# EAGLE design base-3u-psu (EAGLE 4.16)
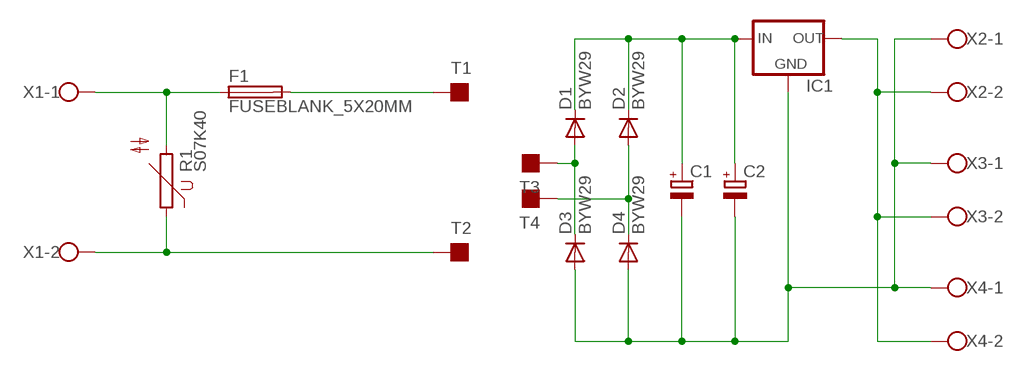
[diagram p0: schematic, sheet 1]

## Parts
C1  CPOL-EUE5-10.5  [E5-10,5]
C2  CPOL-EUE5-10.5  [E5-10,5]
D1  BYW29  [DO220S]
D2  BYW29  [DO220S]
D3  BYW29  [DO220S]
D4  BYW29  [DO220S]
F1  FUSEBLANK_5X20MM  [FUSE_HOLDER_5X20MM]
IC1  78XXS  [78XXS]
R1  S07K40  [S07K40]
T1  TESTPOINTAWG24  [HOLEAWG24]
T2  TESTPOINTAWG24  [HOLEAWG24]
T3  TESTPOINTAWG24  [HOLEAWG24]
T4  TESTPOINTAWG24  [HOLEAWG24]
X1  W237-102  [W237-102]
X2  W237-102  [W237-102]
X3  W237-102  [W237-102]
X4  W237-102  [W237-102]

## Nets
GND: C1.- C2.- D3.A D4.A IC1.GND X2.1 X3.1 X4.1
N$1: C1.+ C2.+ D1.C D2.C IC1.IN
N$2: D1.A D3.C T3.P$1
N$3: D2.A D4.C T4.P$1
N$8: F1.1 R1.2 X1.1
N$9: R1.1 T2.P$1 X1.2
N$10: F1.2 T1.P$1
N$11: IC1.OUT X2.2 X3.2 X4.2

## Library data of the parts
C1 C2 = rcl:CPOL-EU: POLARIZED CAPACITOR, European symbol
D1-D4 = diode:BYW29: DIODE ultra fast rectifier, 200 V, 8 A
F1 = fuse:FUSE: Fuse
IC1 = v-reg:78XXS: VOLTAGE REGULATOR
R1 = varistor:S07K40: VARISTOR
T1-T4 = ads4:TESTPOINT: Test point
X1-X4 = con-wago-500:W237-102: WAGO SCREW CLAMP

## Board
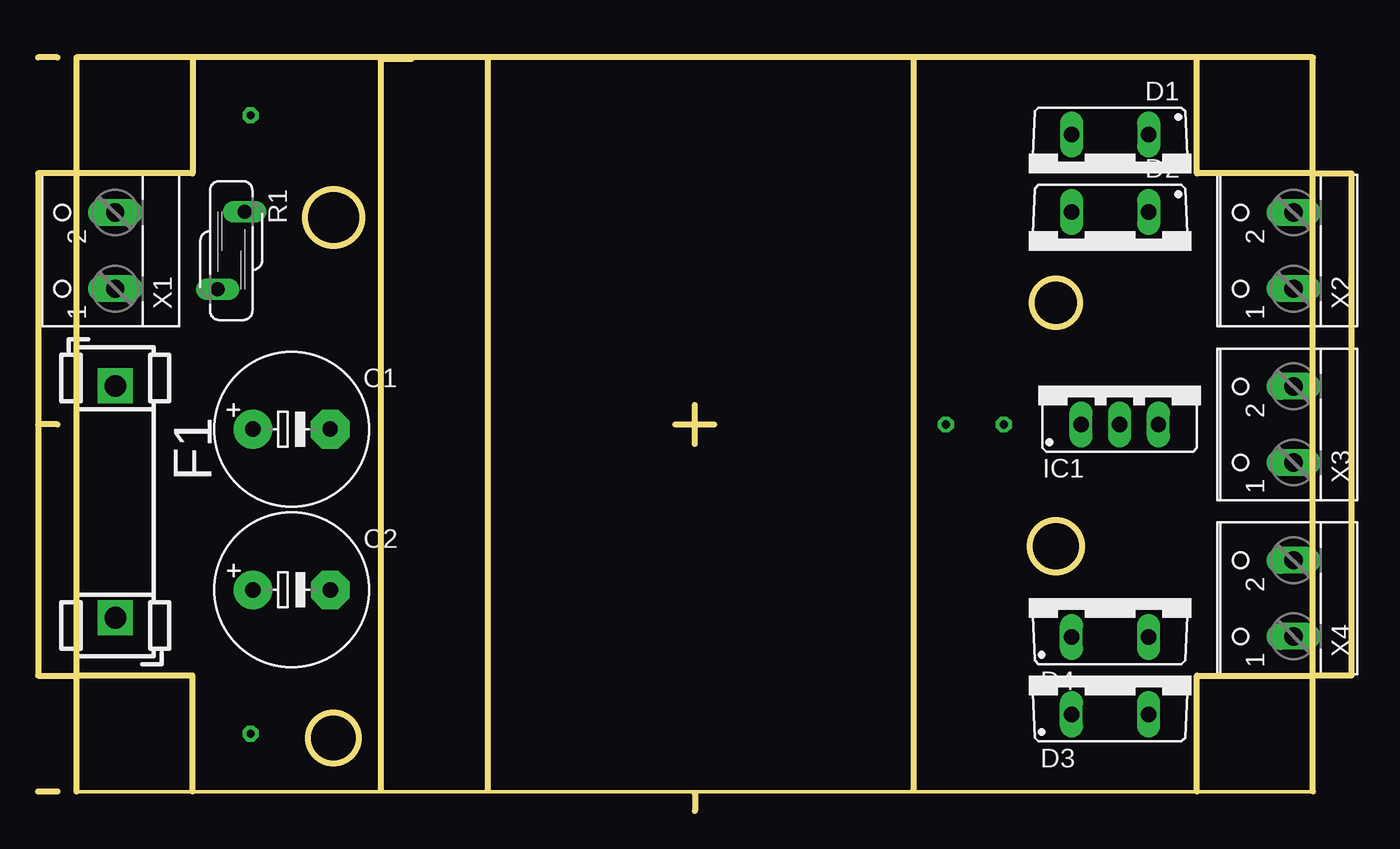
[diagram p1: board, top side]
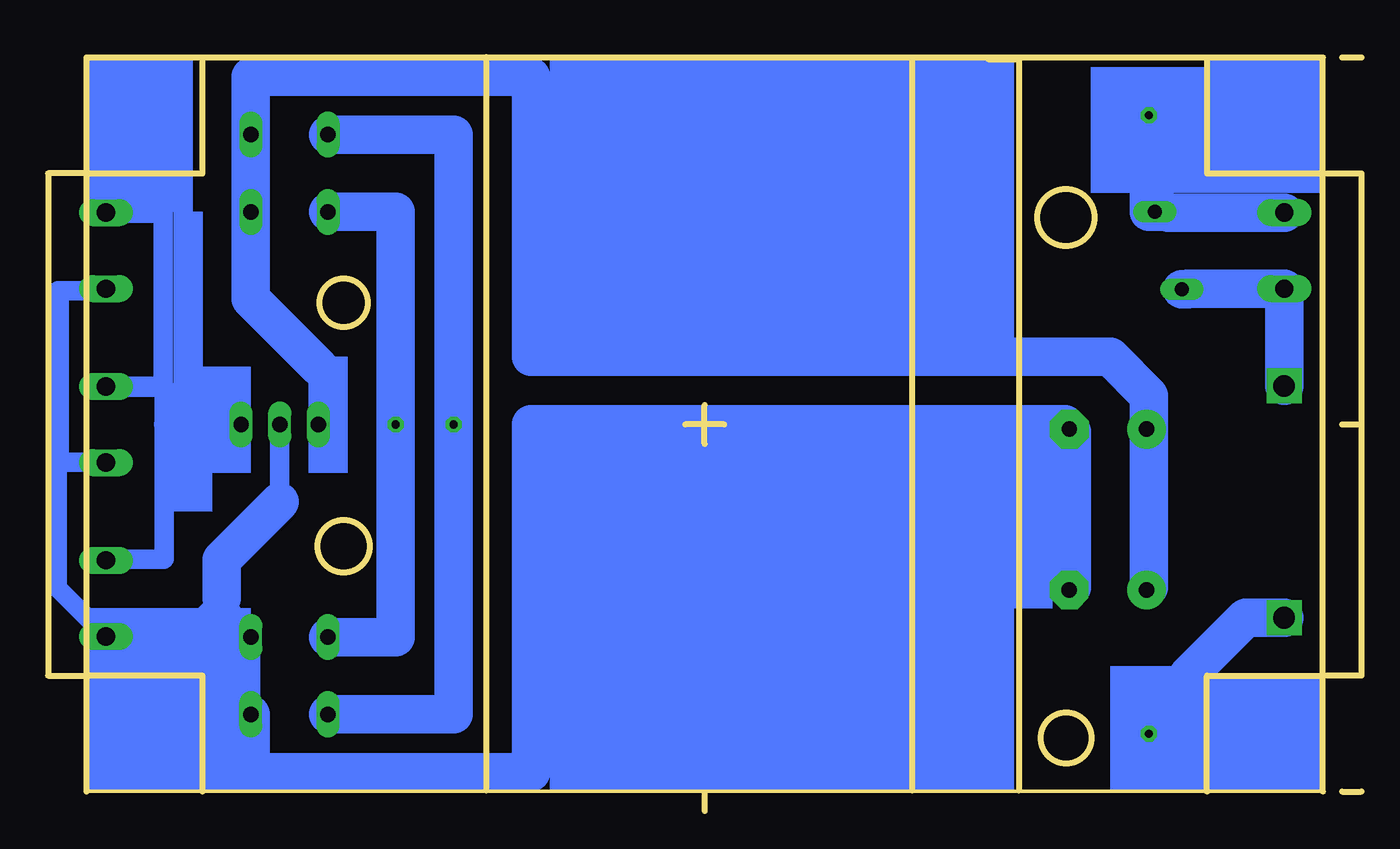
[diagram p2: board, bottom side, seen from below]

Size 86.36 x 49.56 mm. Coordinates in mm from the lower left corner, seen from the top.
Outline: 2.54,1.29 83.82,1.25
Outline: 43.18,1.13 43.18,0
Outline: 1.27,49.53 0,49.53
Outline: 1.27,1.27 0,1.27
Outline: 1.27,25.4 0,25.4
Outline: 41.91,25.4 44.45,25.4
Outline: 43.18,24.13 43.18,26.67
Outline: 2.54,1.27 2.54,8.89
Outline: 2.54,8.89 2.54,41.91
Outline: 2.54,41.91 2.54,49.53 10.16,49.53
Outline: 83.82,1.27 83.82,8.89
Outline: 83.82,8.89 83.82,41.91
Outline: 83.82,41.91 83.82,49.53 76.2,49.53
Outline: 76.2,49.53 10.16,49.53
Outline: 10.16,1.27 10.16,8.89 2.54,8.89
Outline: 76.2,1.27 76.2,8.89 83.82,8.89
Outline: 83.82,41.91 76.2,41.91 76.2,49.53
Outline: 10.16,49.53 10.16,41.91 2.54,41.91
Outline: 2.54,41.91 0,41.91 0,8.89 2.54,8.89
Outline: 83.82,41.91 86.36,41.91 86.36,8.89 83.82,8.89
Outline: 29.58,49.52 29.54,49.52 29.54,1.36
Outline: 57.54,49.56 57.54,1.35
Outline: 24.54,49.41 22.54,49.41 22.54,1.36
Outline: circle at 19.43,39 radius 1.86
Outline: circle at 19.43,4.8 radius 1.66
Outline: circle at 66.93,17.4 radius 1.71
Outline: circle at 66.93,33.4 radius 1.57
Copper layers (1*16): Top 0.035mm / dielectric 1.5mm / Bottom 0.035mm
Design rules "default": minimum track width 10mil, minimum drill 24mil, track to track 8mil, track to pad 8mil, pad to pad 8mil, via to via 8mil, smd to smd 8mil, copper to edge 40mil, drill to drill 8mil, minimum pad ring 10mil, minimum via ring 8mil, stop-mask expansion 4mil, vias tented up to drill 0mil, thermal gap 10mil

### Footprints (pad centres in the part's own frame; a part is rotated, then mirrored left to right if it is on the bottom)
E5-10,5 = drill 1.016 pad 2.54 round: + -2.54,0 | drill 1.016 pad 2.54 octagon: - 2.54,0
DO220S = drill 1.016 long: A 2.54,-2.54; C -2.54,-2.54
FUSE_HOLDER_5X20MM = drill 1.422 pad 2.286 square: 1 0,0; 2 15.24,0
78XXS = drill 1.016 long: GND 0,-2.54; IN -2.54,-2.54; OUT 2.54,-2.54
S07K40 = drill 0.914 long: 1 -0.889,-2.54; 2 0.889,2.54
HOLEAWG24 = drill 0.533 pad 0.787 octagon: P$1 0,0
W237-102 = drill 1.194 long: 1 -2.5,-1.27; 2 2.5,-1.27

### Placement (x,y rotation side)
C1  16.66,25.09 0 top
C2  16.68,14.53 0 top
D1  70.48,41.91 180 top
D2  70.48,36.83 180 top
D3  70.48,8.89 0 top
D4  70.48,13.97 0 top
F1  5.08,27.94 270 top
IC1  71.12,27.94 0 top
R1  12.7,36.83 180 top
T1  13.97,5.08 0 top
T2  13.97,45.72 0 top
T3  59.69,25.4 0 top
T4  63.5,25.4 0 top
X1  3.81,36.83 90 top
X2  81.28,36.83 90 top
X3  81.28,25.4 90 top
X4  81.28,13.97 90 top

### Tracks (layer width: path | path; a pad name or v marks a point on that pad's centre or on a via)
GND
  Bottom 1.27: 82.53,22.93 82.38,22.93 | 82.53,22.93 X3.1 | 85.62,22.93 85.75,22.8 85.75,14.66 X4.1 82.55,11.43 77.47,11.43 74.93,13.97 D4.A D3.A | 85.62,22.93 82.53,22.93 | X2.1 82.69,34.2 85.7,34.2 85.64,34.13 85.64,22.93 85.62,22.93 | 71.12,20.32 IC1.GND
  Bottom 2.54: 71.12,20.32 74.93,16.51 74.93,13.97 | C2.- 19.05,14.7 19.05,24.93 C1.- 19.52,25.4 54.61,25.4 54.61,2.54 73.03,2.54 D3.A
N$1
  Bottom 1.27: 68.58,29.21 IC1.IN
  Bottom 2.54: 68.58,29.21 73.03,33.66 D2.C D1.C 73.03,48.26 54.61,48.26 54.61,29.84 16.51,29.84 13.97,27.3 13.97,25.25 C1.+ 13.97,24.93 13.97,14.7 C2.+
N$2
  Bottom 2.54: D3.C 59.69,6.35 T3.P$1 59.69,44.45 D1.A
N$3
  Bottom 2.54: D2.A 63.5,39.37 T4.P$1 63.5,11.43 D4.C
N$8
  Bottom 2.54: F1.1 X1.1 11.43,34.33 11.43,34.29 R1.2
N$9
  Bottom 2.54: X1.2 12.7,39.33 12.7,39.37 R1.1 13.97,39.37 T2.P$1
N$10
  Bottom 2.54: T1.P$1 11.43,5.08 11.43,8.89 7.62,12.7 F1.2
N$11
  Bottom 1.27: X4.2 82.49,16.53 78.75,16.53 78.72,16.56 78.72,25.4 | 78.72,25.4 78.72,27.89 78.76,27.92 82.57,27.92 | 82.57,27.92 82.66,27.92 | 82.57,27.92 X3.2 82.51,27.86 78.73,27.86 78.8,27.93 78.8,39.43 78.94,39.29 82.51,39.29 X2.2 | 78.72,25.4 78.74,25.4 | 78.72,25.4 IC1.OUT
(copper drawn outside any net)
  shapes: Bottom area x13

### Text on the board
Measures: 49.53 | 39 | 33.4 | 25.4 | 48.26 | 16 | 17.4 | 4.8 | 1.27 | 0 | 16.89 | 40.64 | 64.39 | 81.28 | 47.5